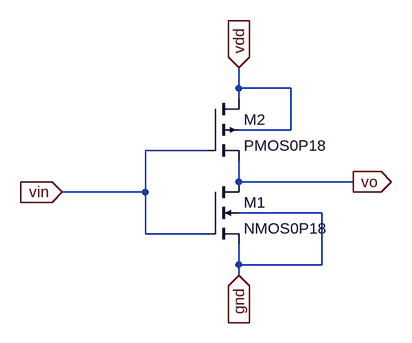
[diagram p0: schematic inv.asc]
inv.asc, the LTspice schematic file:
Version 4.1
SHEET 1 880 680
WIRE 208 -16 208 -48
WIRE 288 -16 208 -16
WIRE 208 0 208 -16
WIRE 288 48 288 -16
WIRE 288 48 208 48
WIRE 160 80 64 80
WIRE 208 128 208 96
WIRE 384 128 208 128
WIRE 64 144 64 80
WIRE 64 144 -64 144
WIRE 336 176 208 176
WIRE 64 208 64 144
WIRE 160 208 64 208
WIRE 208 256 208 224
WIRE 336 256 336 176
WIRE 336 256 208 256
WIRE 208 272 208 256
FLAG -64 144 vin
IOPIN -64 144 In
FLAG 384 128 vo
IOPIN 384 128 Out
FLAG 208 -48 vdd
IOPIN 208 -48 In
FLAG 208 272 gnd
IOPIN 208 272 In
SYMBOL nmos4 160 128 R0
SYMATTR InstName M1
SYMATTR Value NMOS0P18
SYMATTR Value2 l=0.18u w=0.9u
SYMBOL pmos4 160 0 R0
SYMATTR InstName M2
SYMATTR Value PMOS0P18
SYMATTR Value2 l=0.18u w=1.8u

The netlist it stands for:
* inv.asc
M1 vo vin gnd gnd NMOS0P18 l=0.18u w=0.9u
M2 vdd vin vo vdd PMOS0P18 l=0.18u w=1.8u
.model NMOS NMOS
.model PMOS PMOS
.lib standard.mos
.backanno
.end